# Altium schematic sheet Sheet3.SchDoc
size Tabloid
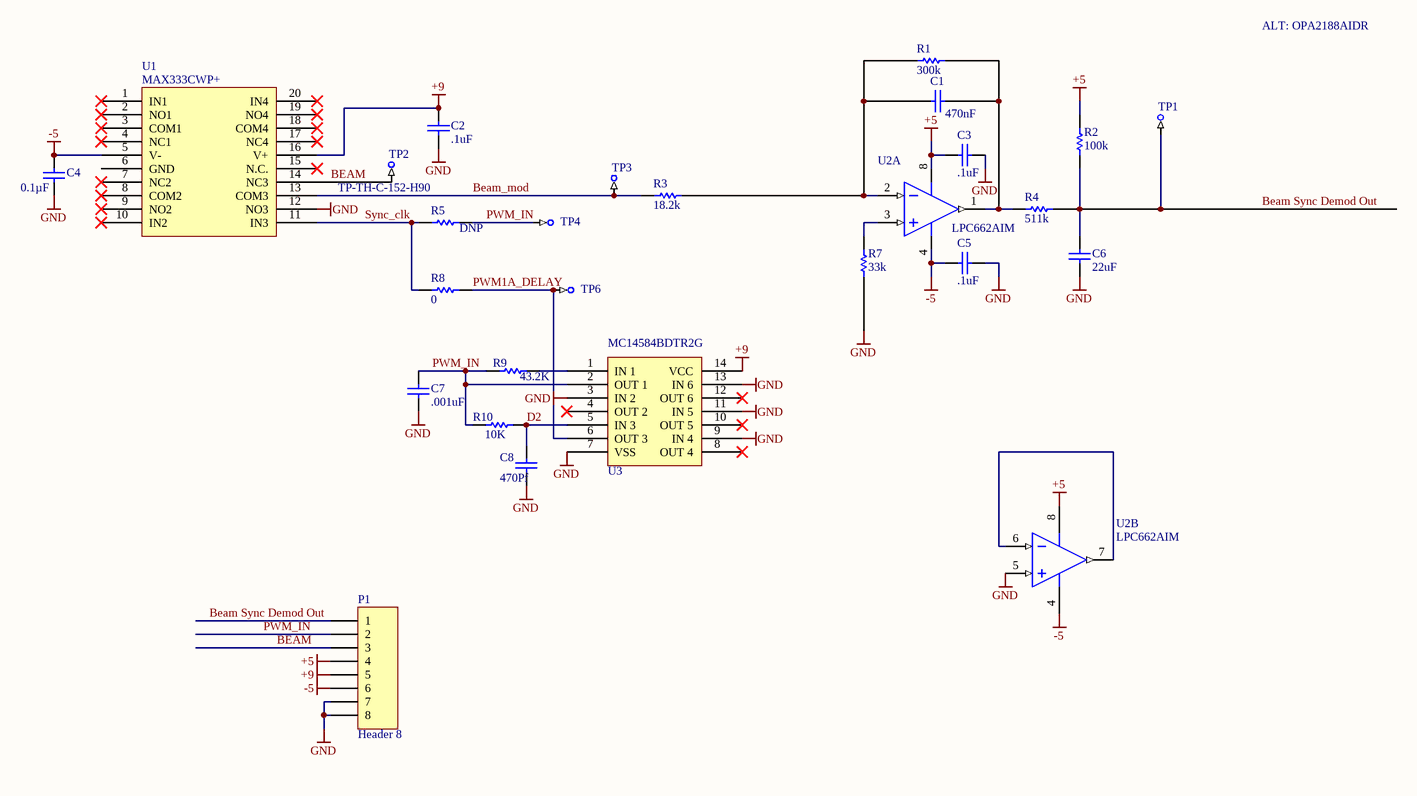
[diagram p0: Sheet3.SchDoc]

## Parts
C1  470nF  [CAPC0805(2012)75_L]
C2  .1uF  [CAPC0805(2012)75_L]
C3  .1uF  [CAPC0805(2012)75_L]
C4  Capacitance: 0.1µF  [CAPC0805(2012)145_N]  (hidden comment: CAP CER 0.1UF 25V X7R 0805)
C5  .1uF  [CAPC0805(2012)75_L]
C6  22uF  [CAPC0805(2012)75_L]
C7  .001uF  [CAPC0805(2012)75_L]
C8  470Pf  [CAPC0805(2012)75_L]
P1  Header 8  [HDR1X8]
R1  300k  [RESC0805(2012)_L]
R2  100k  [RESC0805(2012)_L]
R3  18.2k  [RESC0805(2012)_L]
R4  511k  [RESC0805(2012)_L]
R5  DNP  [RESC0805(2012)_L]
R7  33k  [RESC0805(2012)_L]
R8  0  [RESC0805(2012)_L]
R9  43.2K  [RESC0805(2012)_L]
R10  10K  [RESC0805(2012)_L]
TP1  TP-TH-C-152-H90  [TP-TH-C-152-H90]  (value not drawn)  (no BOM)
TP2  TP-TH-C-152-H90  [TP-TH-C-152-H90]  (no BOM)
TP3  TP-TH-C-152-H90  [TP-TH-C-152-H90]  (value not drawn)  (no BOM)
TP4  TP-TH-C-152-H90  [TP-TH-C-152-H90]  (value not drawn)  (no BOM)
TP6  TP-TH-C-152-H90  [TP-TH-C-152-H90]  (value not drawn)  (no BOM)
U1  MAX333CWP+  [TSOP65P640X90-20N]
U2  LPC662AIM  [D0008A_M]  (parts A,B of 2)
U3  MC14584BDTR2G  [MC14584BDTR2G]

## Nets
+5: C3.1 P1.4 R2.2 U2.8(V+)
+9: C2.2 P1.5 U1.16(V+) U3.14(VCC)
-5: C4.1 C5.1 P1.6 U1.5(V-) U2.4(V-)
GND: C2.1 C3.2 C4.2 C5.2 C6.1 C7.1 C8.1 P1.7 P1.8 R7.1 U1.12(NO3) U2.5(INB+) U3.3(IN_2) U3.7(VSS) U3.9(IN_4) U3.11(IN_5) U3.13(IN_6)
BEAM: P1.3 TP2.1 U1.14(NC3)
Beam Sync Demod Out: C6.2 P1.1 R2.1 R4.1 TP1.1
Beam_mod: R3.2 TP3.1 U1.13(COM3)
D2: C8.2 R10.1 U3.5(IN_3)
PWM1A_DELAY: R8.1 TP6.1 U3.6(OUT_3)
PWM_IN: C7.2 P1.2 R5.1 R9.2 R10.2 TP4.1 U3.2(OUT_1)
Sync_clk: R5.2 R8.2 U1.11(IN3)
NetC1_1: C1.1 R1.2 R3.1 U2.2(INA-)
NetC1_2: C1.2 R1.1 R4.2 U2.1(OUTA)
NetR7_2: R7.2 U2.3(INA+)
NetR9_1: R9.1 U3.1(IN_1)
NetU2_6: U2.6(INB-) U2.7(OUTB)

Not connected (* = marked no-connect by the designer): U1 1(IN1)* 2(NO1)* 3(COM1)* 4(NC1)* 6(GND) 7(NC2)* 8(COM2)* 9(NO2)* 10(IN2)* 15(N.C.)* 17(NC4)* 18(COM4)* 19(NO4)* 20(IN4)*; U3 4(OUT_2)* 8(OUT_4)* 10(OUT_5)* 12(OUT_6)*

## Notes on the sheet
- ALT: OPA2188AIDR
- Title
- Size:
- Date:
- Tabloid
- Number:
- Time:
- Revision:
- Sheet
- of
- ZLS Corporation
- 7801 North Lamar Blvd.
- Suite E-184
- Austin, Texas 78752  USA
- (512) 453-0288
- File:

## Library data of the parts
C1 = CMP-1036-02117-1: CAP 150pF 16V ±10% 0805 (2012 Metric) Thickness 0.75mm SMD; Case-EIA: 0805; Tolerance: Â±10%; Value: .47uF; Case-Metric: 2012; Technology: SMT; Max Thickness: 0.75 mm; Rated Voltage: 16 V
C2 C3 C5-C8 = CMP-1036-02117-1: CAP 150pF 16V ±10% 0805 (2012 Metric) Thickness 0.75mm SMD; Case-EIA: 0805; Tolerance: Â±10%; Case-Metric: 2012; Technology: SMT; Max Thickness: 0.75 mm; Rated Voltage: 16 V
  C2 C3 C5: Value: .1uF
  C6: Value: 22uF
  C7: Value: .001uF
  C8: Value: 470Pf
C4 = CMP-1036-04795-1: Manufacturer: Murata Electronics North America; Manufacturer Part Number: GRM21BR71E104KA01L; Tolerance: ±10%; Supplier 1: Digi-Key; Supplier Part Number 1: 490-1673-6-ND; RoHS: RoHS Compliant; Category: Capacitors; Stock 1: 891652; Pricing 1: 1=0.2, 10=0.145, 100=0.0683, 500=0.04788, 1000=0.03964 (USD); Packaging: Digi-Reel®; Part Status: Active; Voltage - Rated: 25V; Temperature Coefficient: X7R; Operating Temperature: -55°C ~ 125°C; Features: -; Ratings: -; Applications: General Purpose; Mounting Type: Surface Mount, MLCC; Package / Case: 0805 (2012 Metric); Size / Dimension: 0.079" L x 0.049" W (2.00mm x 1.25mm); Height - Seated (Max): -; Thickness (Max): 0.053" (1.35mm); Lead Spacing: -; Lead Style: -; ComponentLink1URL: http://www.murata.com/~/media/webrenewal/support/library/catalog/products/capacitor/mlcc/c02e.ashx; ComponentLink1Description: http://www.murata.com/~/media/webrenewal/support/library/catalog/products/capacitor/mlcc/c02e.ashx
P1 = Header 8: Header, 8-Pin; LatestRevisionDate: 17-Jul-2002; LatestRevisionNote: Re-released for DXP Platform.; Publisher: Altium Limited
R1-R4 R7-R10 = CMP-1013-00215-1: 2R55 0.125W 1% 0805 (2012 Metric)  SMD; Case-Metric: 2012; Case-EIA: 0805; Tolerance: 1 %; Technology: SMT; Power: 0.125 W
  R1: Value: 300k
  R2: Value: 100k
  R3: Value: 18.2k
  R4: Value: 511k
  R7: Value: 33k
  R8: Value: 0
  R9: Value: 43.2K
  R10: Value: 10K
R5 = CMP-1013-00215-1: 2R55 0.125W 1% 0805 (2012 Metric)  SMD; Case-Metric: 2012; Value: 0; Case-EIA: 0805; Tolerance: 1 %; Technology: SMT; Power: 0.125 W
TP1-TP4 TP6 = CMP-0484-00003-2: Test Point, Through Hole, Hole Size 0.9 mm, PCB Mount with Silkscreen Box; Manufacturer: No Vendor; PartNumber: TP-TH-C-152-H90
U1 = MAX333CWP+: IC SWITCH QUAD SPDT 20TSSOP; Manufacturer: Maxim; Manufacturer Part Number: MAX333AEUP+; Max Supply Voltage: 30V; Min Supply Voltage: 10V; Min Dual Supply Voltage: 4.5V; Max Dual Supply Voltage: 20V; On-State Resistance: 35R; Operating Supply Current: 1uA; Supply Type: Single,Dual; Max Power Dissipation: 559mW; Turn-On Delay Time: 175ns; Turn-Off Delay Time: 145ns; Max Supply Current: 250uA; Number of Bits: 4; Dual Supply Voltage: 15V; Supplier 1: Mouser; Supplier Part Number 1: 700-MAX333AEUP; Stock 1: 664; Pricing 1: 1=6.77, 10=6.43, 50=5.8, 100=5.8, 1000=5.62, 10000=5.62 (USD); Case/Package: TSSOP; Number of Pins: 20; Weight: 0.006737oz; Min Operating Temperature: -40°C; Max Operating Temperature: 85°C; Packaging: Rail/Tube; Package Quantity: 74; Throw Configuration: SPDT; Number of Channels: 4; Length: 6.6mm; Height: 0.95mm; Width: 4.5mm; Radiation Hardening: No; Lead Free: Lead Free; REACH SVHC: Unknown; ComponentLink1URL: https://datasheet.ciiva.com/2978/max333a-2978850.pdf; ComponentLink1Description: https://datasheet.ciiva.com/2978/max333a-2978850.pdf; ComponentLink2URL: https://datasheet.ciiva.com/30478/0900766b81253c85-30478260.pdf; ComponentLink2Description: https://datasheet.ciiva.com/30478/0900766b81253c85-30478260.pdf; ComponentLink3URL: https://datasheet.ciiva.com/1674/max333a-1674617.pdf; ComponentLink3Description: https://datasheet.ciiva.com/1674/max333a-1674617.pdf; ComponentLink4URL: https://datasheet.ciiva.com/26825/max333aeup-26825546.pdf; ComponentLink4Description: https://datasheet.ciiva.com/26825/max333aeup-26825546.pdf
U2 = CMP-0055-00867-3: Low Power CMOS Dual Operational Amplifier, 8-pin Narrow SOIC; Manufacturer: Texas Instruments; PowerWise: N; CompType: Amplifiers; PackageTopMarking: NSZXTT*LPC66*2AIM; PinCount: 8; Code_JEDEC: MS-012-AA; ComponentLink1URL: http://www.ti.com/general/docs/lit/getliterature.tsp?genericPartNumber=LPC662&fileType=pdf; Code_IPC: SOIC127P600-8; Package Reference: D0008A; PackageDescription: SOIC Narrow, 4.9 x 3.9 x 1.45mm, 8 Lead, 1.27mm Pitch; RoHS: N; ComponentLink1Description: Datasheet URL; PartId: 1
U3 = MC14584BDTR2G: Manufacturer: ON Semiconductor; Logic Type: Inverter; Number of Inputs: 6; Voltage - Supply: 3 V ~ 18 V; Current - Output High, Low: 8.8mA, 8.8mA; Logic Level - Low: 1.6 V ~ 4.6 V; Logic Level - High: 3.4 V ~ 10.5 V; Max Propagation Delay @ V, Max CL: 80ns @ 15V, 50pF; Supplier 1: Digi-Key; Supplier Part Number 1: MC14584BDTR2GOSCT-ND; Manufacturer Part Number: MC14584BDTR2G; RoHS: RoHS Compliant; Category: Integrated Circuits (ICs); Stock 1: 5429; Pricing 1: 1=0.5, 10=0.43, 100=0.3213, 500=0.25242, 1000=0.19506 (USD); Packaging: Cut Tape (CT); Part Status: Active; Features: Schmitt Trigger; Operating Temperature: -55°C ~ 125°C; Mounting Type: Surface Mount; Supplier Device Package: 14-TSSOP; Package / Case: 14-TSSOP (0.173", 4.40mm Width); Base Part Number: 4584; ComponentLink1URL: http://www.onsemi.com/pub/Collateral/MC14584B-D.PDF; ComponentLink1Description: http://www.onsemi.com/pub/Collateral/MC14584B-D.PDF